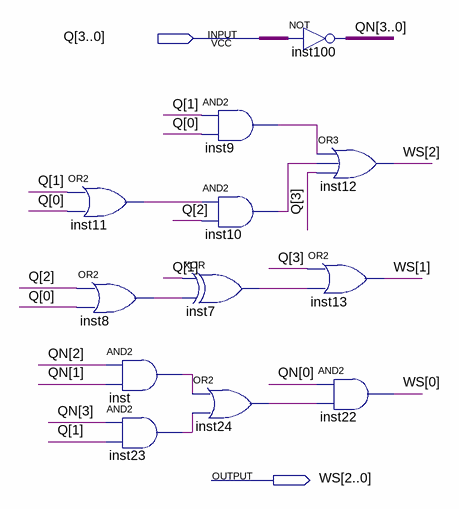
[diagram p0: schematic sheet]
// Quartus schematic WS.bdf as structural Verilog: 12 symbols, 2 pins
module WS (
  input  [3:0] Q,
  output [2:0] WS
);

  wire inst7_out, inst8_out, inst9_out, inst10_out, inst11_out, inst23_out, inst24_out, inst_out;
  wire [3:0] QN;

  or inst11 (inst11_out, Q[1], Q[0]);
  or inst8 (inst8_out, Q[2], Q[0]);
  and inst (inst_out, QN[2], QN[1]);
  and inst23 (inst23_out, QN[3], Q[1]);
  and inst9 (inst9_out, Q[1], Q[0]);
  and inst10 (inst10_out, inst11_out, Q[2]);
  xor inst7 (inst7_out, Q[1], inst8_out);
  or inst24 (inst24_out, inst_out, inst23_out);
  assign QN = ~Q;  // NOT inst100, 4 bits wide
  or inst12 (WS[2], inst9_out, inst10_out, Q[3]);
  or inst13 (WS[1], Q[3], inst7_out);
  and inst22 (WS[0], QN[0], inst24_out);
endmodule
